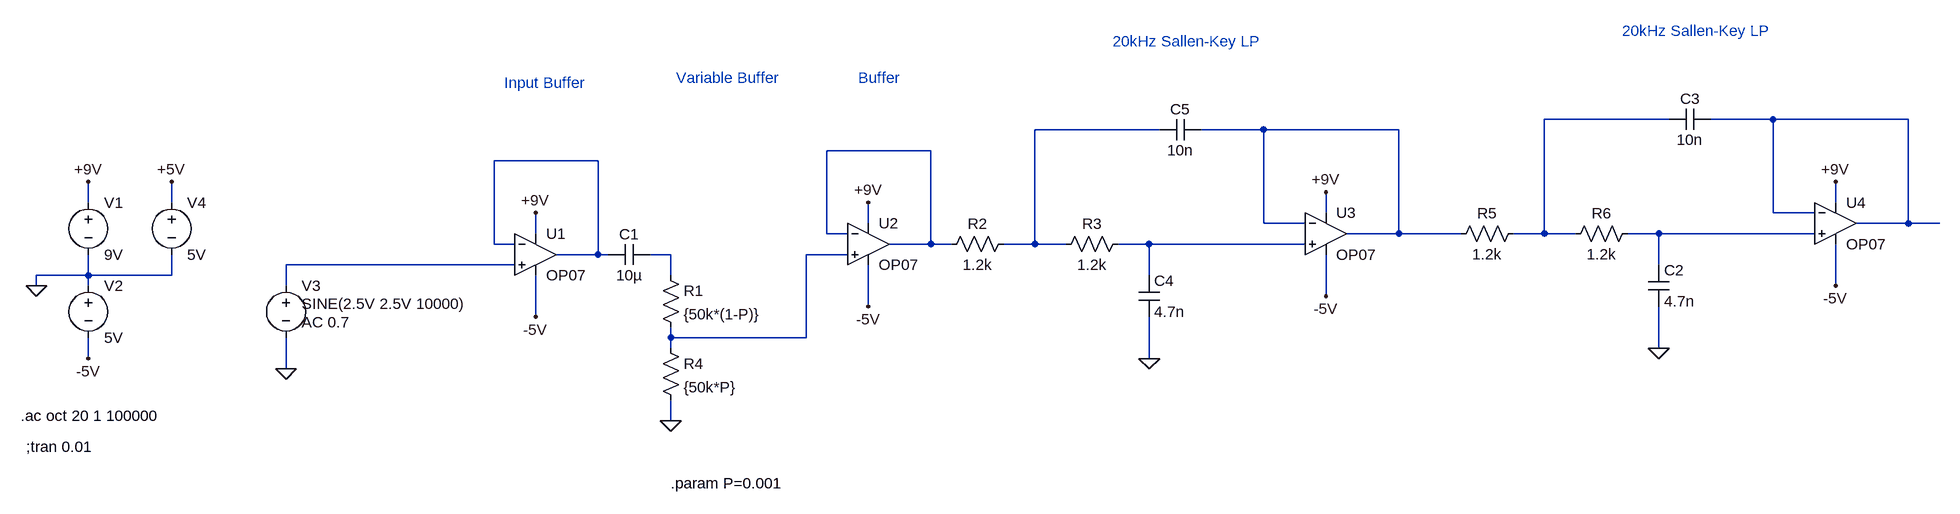
[diagram p0: schematic AudioOutput.asc]
AudioOutput.asc, the LTspice schematic file:
Version 4
SHEET 1 2964 680
WIRE 2400 -64 2208 -64
WIRE 2560 -64 2464 -64
WIRE 2768 -64 2560 -64
WIRE 1616 -48 1424 -48
WIRE 1776 -48 1680 -48
WIRE 1984 -48 1776 -48
WIRE 1264 -16 1104 -16
WIRE 752 0 592 0
WIRE -32 64 -32 32
WIRE 96 64 96 32
WIRE 2656 64 2656 32
WIRE 1872 80 1872 48
WIRE 2560 80 2560 -64
WIRE 2624 80 2560 80
WIRE 1168 96 1168 64
WIRE 1776 96 1776 -48
WIRE 1840 96 1776 96
WIRE 2768 96 2768 -64
WIRE 2768 96 2688 96
WIRE 2816 96 2768 96
WIRE 656 112 656 80
WIRE 1104 112 1104 -16
WIRE 1136 112 1104 112
WIRE 1984 112 1984 -48
WIRE 1984 112 1904 112
WIRE 2080 112 1984 112
WIRE 2208 112 2208 -64
WIRE 2208 112 2160 112
WIRE 2256 112 2208 112
WIRE 2384 112 2336 112
WIRE 2624 112 2384 112
WIRE 592 128 592 0
WIRE 624 128 592 128
WIRE 1264 128 1264 -16
WIRE 1264 128 1200 128
WIRE 1296 128 1264 128
WIRE 1424 128 1424 -48
WIRE 1424 128 1376 128
WIRE 1472 128 1424 128
WIRE 1600 128 1552 128
WIRE 1840 128 1600 128
WIRE 752 144 752 0
WIRE 752 144 688 144
WIRE 768 144 752 144
WIRE 864 144 832 144
WIRE 1136 144 1072 144
WIRE 624 160 272 160
WIRE 2384 160 2384 112
WIRE -32 176 -32 144
WIRE -32 176 -112 176
WIRE 96 176 96 144
WIRE 96 176 -32 176
WIRE 864 176 864 144
WIRE 1600 176 1600 128
WIRE -112 192 -112 176
WIRE -32 192 -32 176
WIRE 272 192 272 160
WIRE 2656 192 2656 128
WIRE 1872 208 1872 144
WIRE 1168 224 1168 160
WIRE 656 240 656 176
WIRE 864 272 864 256
WIRE 1072 272 1072 144
WIRE 1072 272 864 272
WIRE 864 288 864 272
WIRE 2384 288 2384 224
WIRE -32 304 -32 272
WIRE 1600 304 1600 240
WIRE 272 320 272 272
WIRE 864 400 864 368
FLAG -112 192 0
FLAG -32 32 +9V
FLAG 96 32 +5V
FLAG -32 304 -5V
FLAG 656 240 -5V
FLAG 656 80 +9V
FLAG 272 320 0
FLAG 864 400 0
FLAG 1872 208 -5V
FLAG 1872 48 +9V
FLAG 1600 304 0
FLAG 1168 224 -5V
FLAG 1168 64 +9V
FLAG 2656 192 -5V
FLAG 2656 32 +9V
FLAG 2384 288 0
SYMBOL voltage -32 48 R0
WINDOW 123 0 0 Left 0
WINDOW 39 0 0 Left 0
SYMATTR InstName V1
SYMATTR Value 9V
SYMBOL voltage -32 176 R0
WINDOW 123 0 0 Left 0
WINDOW 39 0 0 Left 0
SYMATTR InstName V2
SYMATTR Value 5V
SYMBOL voltage 96 48 R0
WINDOW 123 0 0 Left 0
WINDOW 39 0 0 Left 0
SYMATTR InstName V4
SYMATTR Value 5V
SYMBOL Opamps\\OP07 656 80 R0
SYMATTR InstName U1
SYMBOL voltage 272 176 R0
WINDOW 3 24 44 Left 2
WINDOW 123 24 72 Left 2
WINDOW 39 0 0 Left 0
SYMATTR Value SINE(2.5V 2.5V 10000)
SYMATTR Value2 AC 0.7
SYMATTR InstName V3
SYMBOL res 848 160 R0
SYMATTR InstName R1
SYMATTR Value {50k*(1-P)}
SYMBOL cap 832 128 R90
WINDOW 0 0 32 VBottom 2
WINDOW 3 32 32 VTop 2
SYMATTR InstName C1
SYMATTR Value 10µ
SYMBOL res 848 272 R0
SYMATTR InstName R4
SYMATTR Value {50k*P}
SYMBOL cap 1584 176 R0
SYMATTR InstName C4
SYMATTR Value 4.7n
SYMBOL cap 1680 -64 R90
WINDOW 0 0 32 VBottom 2
WINDOW 3 32 32 VTop 2
SYMATTR InstName C5
SYMATTR Value 10n
SYMBOL Opamps\\OP07 1872 48 R0
SYMATTR InstName U3
SYMBOL res 1392 112 R90
WINDOW 0 0 56 VBottom 2
WINDOW 3 32 56 VTop 2
SYMATTR InstName R2
SYMATTR Value 1.2k
SYMBOL res 1568 112 R90
WINDOW 0 0 56 VBottom 2
WINDOW 3 32 56 VTop 2
SYMATTR InstName R3
SYMATTR Value 1.2k
SYMBOL Opamps\\OP07 1168 64 R0
SYMATTR InstName U2
SYMBOL cap 2368 160 R0
SYMATTR InstName C2
SYMATTR Value 4.7n
SYMBOL cap 2464 -80 R90
WINDOW 0 0 32 VBottom 2
WINDOW 3 32 32 VTop 2
SYMATTR InstName C3
SYMATTR Value 10n
SYMBOL Opamps\\OP07 2656 32 R0
SYMATTR InstName U4
SYMBOL res 2176 96 R90
WINDOW 0 0 56 VBottom 2
WINDOW 3 32 56 VTop 2
SYMATTR InstName R5
SYMATTR Value 1.2k
SYMBOL res 2352 96 R90
WINDOW 0 0 56 VBottom 2
WINDOW 3 32 56 VTop 2
SYMATTR InstName R6
SYMATTR Value 1.2k
TEXT -136 392 Left 2 !.ac oct 20 1 100000
TEXT -128 440 Left 2 !;tran 0.01
TEXT 864 496 Left 2 !.param P=0.001
TEXT 1544 -184 Left 2 ;20kHz Sallen-Key LP
TEXT 2328 -200 Left 2 ;20kHz Sallen-Key LP
TEXT 608 -120 Left 2 ;Input Buffer
TEXT 872 -128 Left 2 ;Variable Buffer
TEXT 1152 -128 Left 2 ;Buffer

The netlist it stands for:
* AudioOutput.asc
V1 +9V 0 9V
V2 0 -5V 5V
V4 +5V 0 5V
XU1 N011 N006 +9V -5V N006 LT1001  ; OP07, pins In+ In- V+ V- OUT
V3 N011 0 SINE(2.5V 2.5V 10000) AC 0.7
R1 N009 N010 {50k*(1-P)}
C1 N009 N006 10µ
R4 N010 0 {50k*P}
C4 N008 0 4.7n
C5 N004 N003 10n
XU3 N008 N004 +9V -5V N004 LT1001  ; OP07, pins In+ In- V+ V- OUT
R2 N003 N005 1.2k
R3 N008 N003 1.2k
XU2 N010 N005 +9V -5V N005 LT1001  ; OP07, pins In+ In- V+ V- OUT
C2 N007 0 4.7n
C3 N002 N001 10n
XU4 N007 N002 +9V -5V N002 LT1001  ; OP07, pins In+ In- V+ V- OUT
R5 N001 N004 1.2k
R6 N007 N001 1.2k
.ac oct 20 1 100000
;tran 0.01
.param P=0.001
* 20kHz Sallen-Key LP
* 20kHz Sallen-Key LP
* Input Buffer
* Variable Buffer
* Buffer
.lib LTC.lib
.backanno
.end